# Altium schematic sheet iSOLATED RS485.SchDoc
size A; SheetNumber: 3; SheetTotal: 3
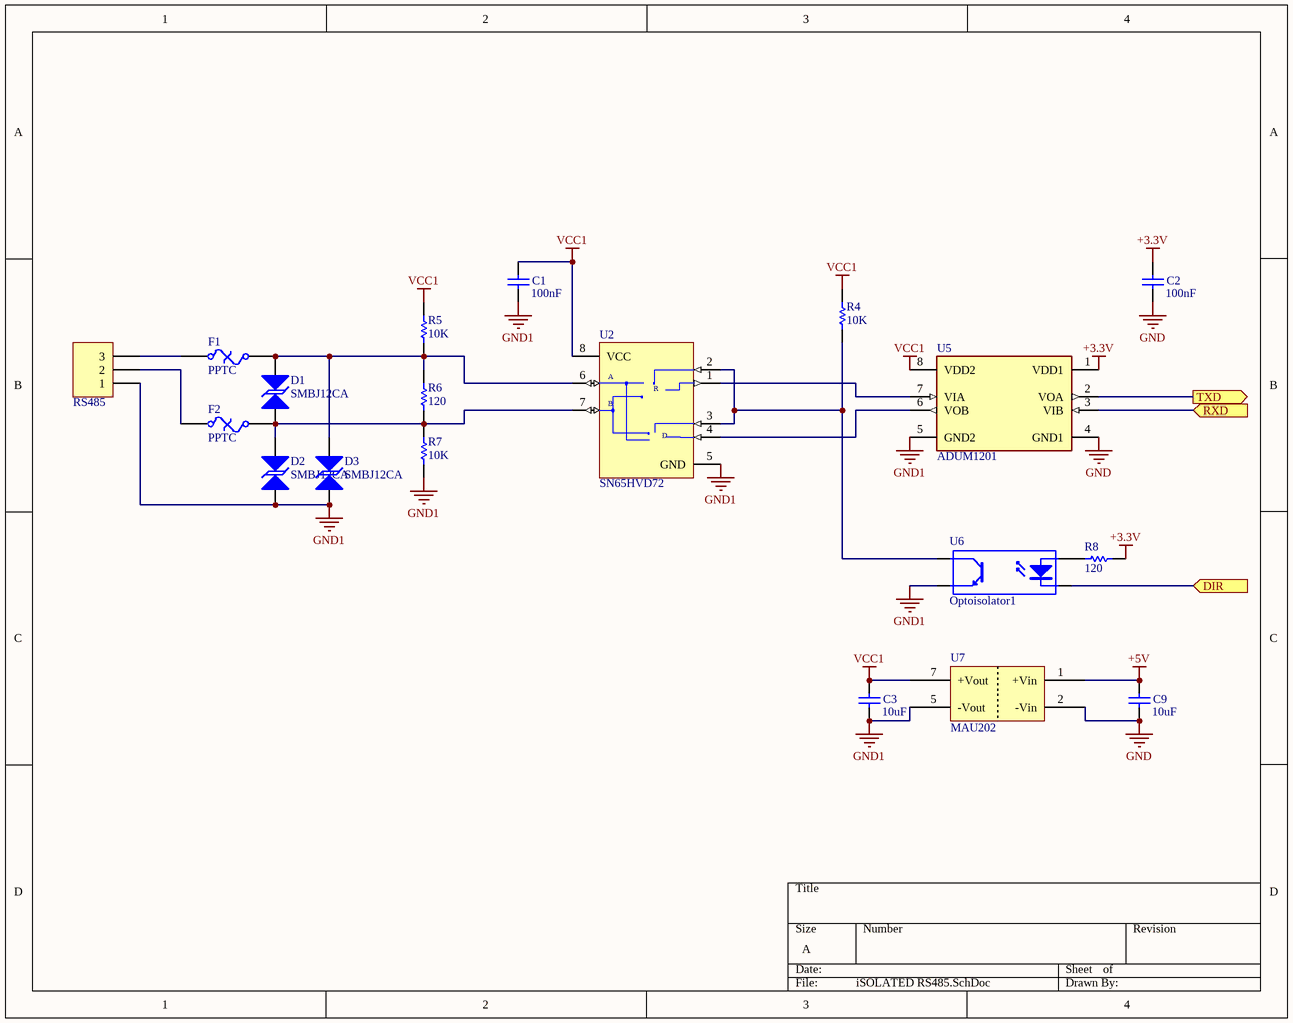
[diagram p0: iSOLATED RS485.SchDoc]

## Parts
C1  100nF  [C603]
C2  100nF  [C603]
C3  10uF  [C1206]
C9  10uF  [C1206]
D1  SMBJ12CA  [DO-214AA]
D2  SMBJ12CA  [DO-214AA]
D3  SMBJ12CA  [DO-214AA]
F1  PPTC  [PTC-0805]
F2  PPTC  [PTC-0805]
R4  10K  [R805]
R5  10K  [R805]
R6  120  [R805]
R7  10K  [R805]
R8  120  [R805]
RS485  CONN-3  [XH-3]  (value not drawn)
U2  SN65HVD72  [SOIC-8N]
U5  ADUM1201  [soic-8n]
U6  Optoisolator1  [SOIC-4]
U7  MAU202  [MAU202]

## Ports
DIR (in), RXD (in), TXD (out)

## Nets
+3.3V: C2.2 R8.1 U5.1(VDD1)
+5V: C9.2 U7.1(+Vin)
GND: C2.1 C9.1 U5.4(GND1) U7.2(-Vin)
GND1: C1.1 C3.1 D2.1(A) D3.1(A) R7.1 RS485.1 U2.5(GND) U5.5(GND2) U6.3(E) U7.5(-Vout)
VCC1: C1.2 C3.2 R4.2 R5.2 U2.8(VCC) U5.8(VDD2) U7.7(+Vout)
DIR: U6.2(K) ; port DIR
RXD: U5.3(VIB) ; port RXD
TXD: U5.2(VOA) ; port TXD
NetD1_1: D1.1(A) D2.2(K) F2.2 R6.1 R7.2 U2.7(B)
NetD1_2: D1.2(K) D3.2(K) F1.2 R5.1 R6.2 U2.6(A)
NetF1_1: F1.1 RS485.3
NetF2_1: F2.1 RS485.2
NetR4_1: R4.1 U2.2(~{RE}) U2.3(DE) U6.4(C)
NetR8_2: R8.2 U6.1(A)
NetU2_1: U2.1(RO) U5.7(VIA)
NetU2_4: U2.4(DI) U5.6(VOB)

## Notes on the sheet
- (in symbol SN65HVD72) R; D

## Library data of the parts
C1-C3 C9 = Cap: Capacitor; Designer: Parsa Malekpour
  C1 C2: Value: 100nF
  C3 C9: Value: 10uF
D1-D3 = SMBJxxCA: Surface Mount Transient Voltage Suppressors Diode; Parameter 1: *
F1 F2 = Fuse Thermal: Thermal Fuse; Published: 24-Mar-1999; LatestRevisionDate: 17-Jul-2002; LatestRevisionNote: Re-released for DXP Platform.; PackageReference: PIN-W2/E2.8; Publisher: Altium Limited; PackageDescription: Thru-Hole; 2 Leads
R4-R8 = Resistor: Designer: Parsa Malekpour
  R4 R5 R7: Value: 10K
  R6 R8: Value: 120
RS485 = CONN-3: Header, 3-Pin
U2 = SN65HVD72: 3.3-V Supply RS-485 With IEC ESD protection; Published: 16-Jan-2001; LatestRevisionDate: 29-May-2009; LatestRevisionNote: Component Body Added.; DatasheetVersion: Feb-1996; PackageVersion: RevB, 21-0043; PackageReference: PA8; Publisher: Altium Limited; PackageDescription: DIP, 8-Pin, Row Spacing 7.62 mm, Pitch 2.54 mm; Code_JEDEC: MS-001-AB
U5 = ADUM1201: Dual-Channel Digital Isolators; MF: {'manufacturer': u'Analog Devices'}; MP: ADUM1201AR; Package: None; Price: None; Value: *; Availability: Unavailable
U6 = Optoisolator1: 4-Pin Phototransistor Optocoupler; Published: 24-Mar-1999; LatestRevisionDate: 04-Mar-2005; LatestRevisionNote: Sch pins 3 & 4 Swapped.; DatasheetVersion: Nov-2003; PackageReference: DIP-4; Publisher: Altium Limited
U7 = MAU202: 1W, FIXED INPUT ISOLATED & UNREGULATED / SINGLE OUTPUT DC-DC CONVERTER